# EAGLE schematic uFTDI4x4r1 (EAGLE 6.2)
Assembly variants: USB_BUS_POWERED, USB_SELF_POWERED, SMD_ONLY
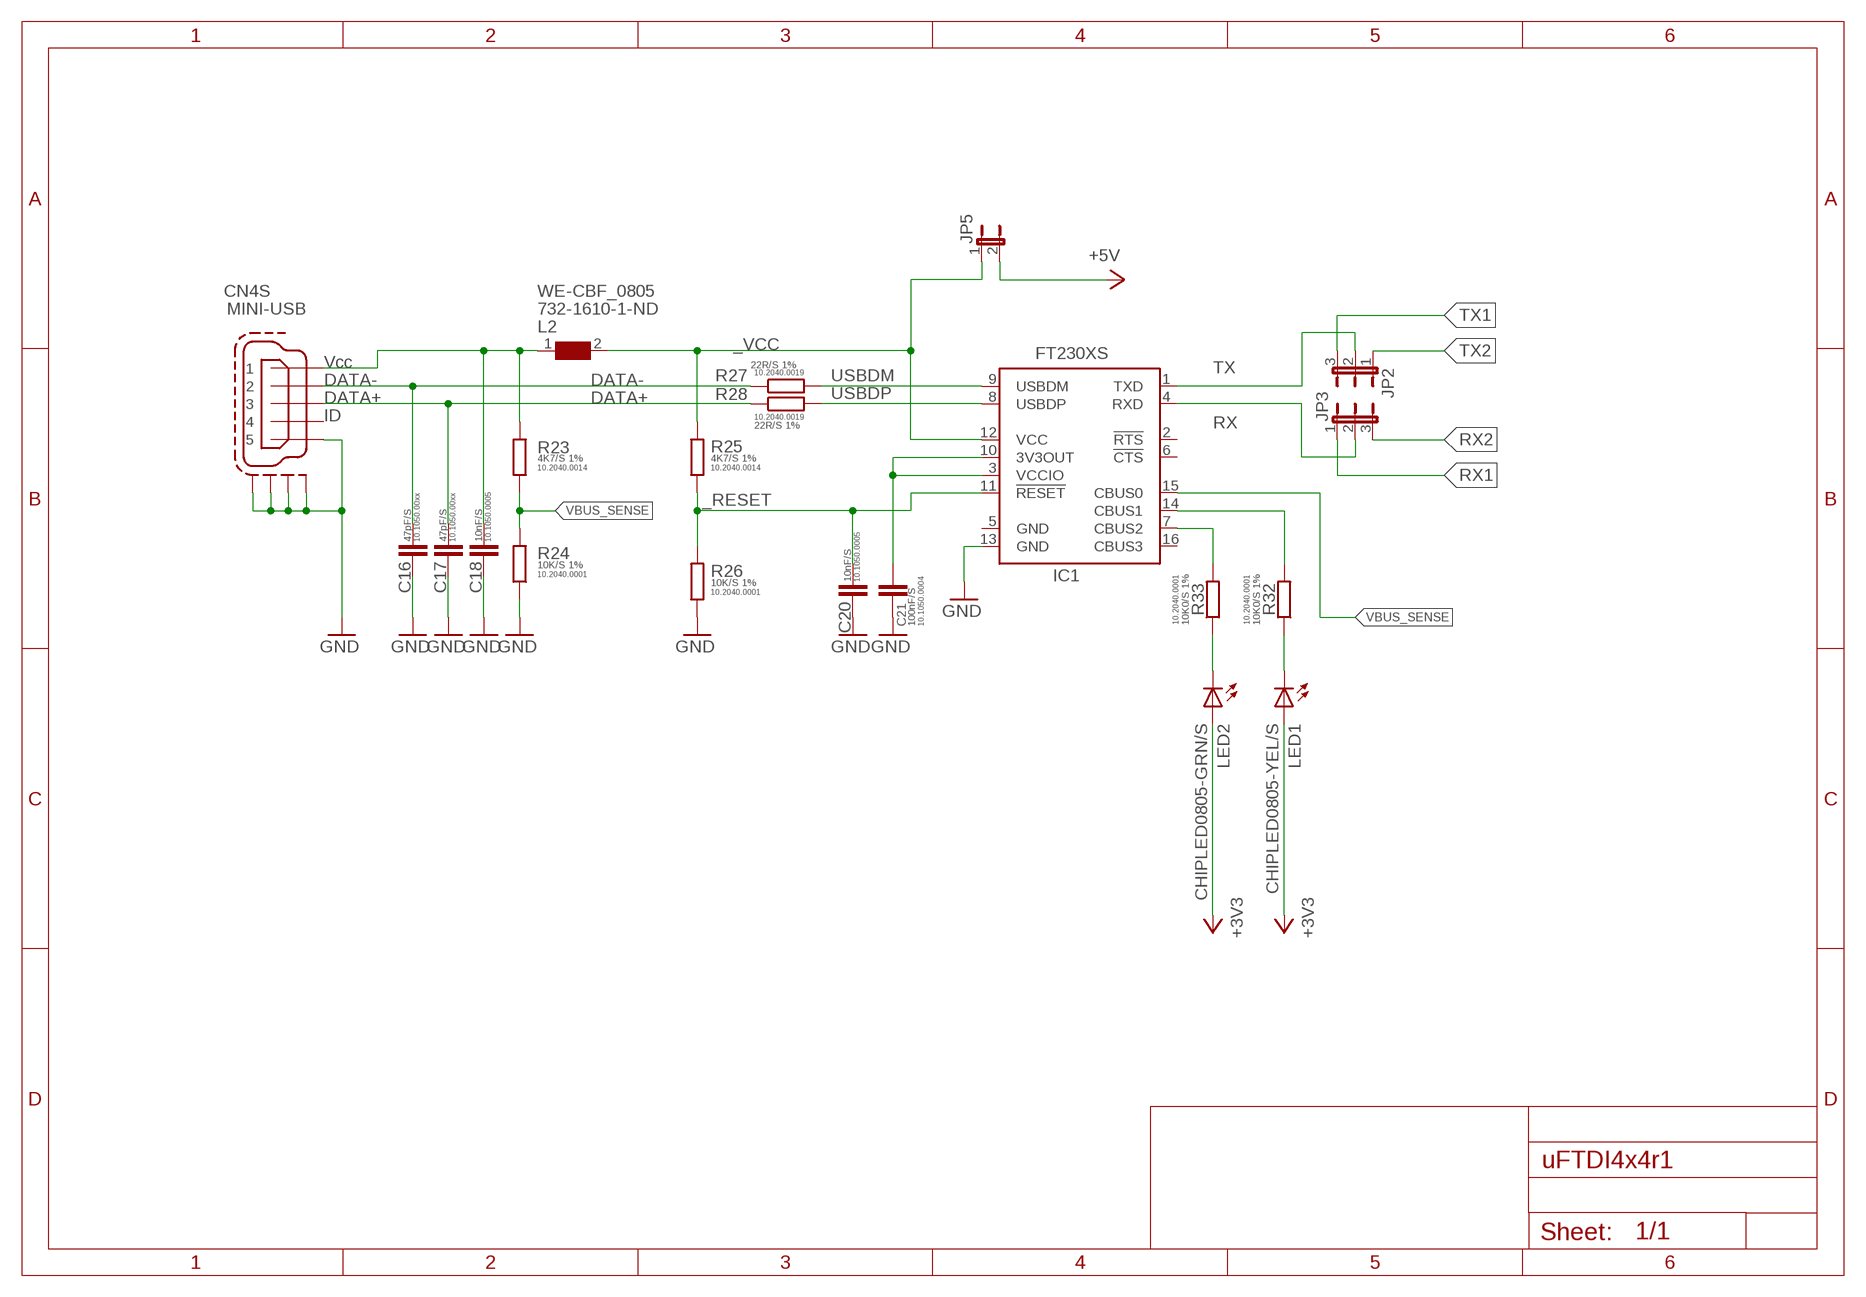
[diagram p0: schematic, sheet 1, part 1 of 2]
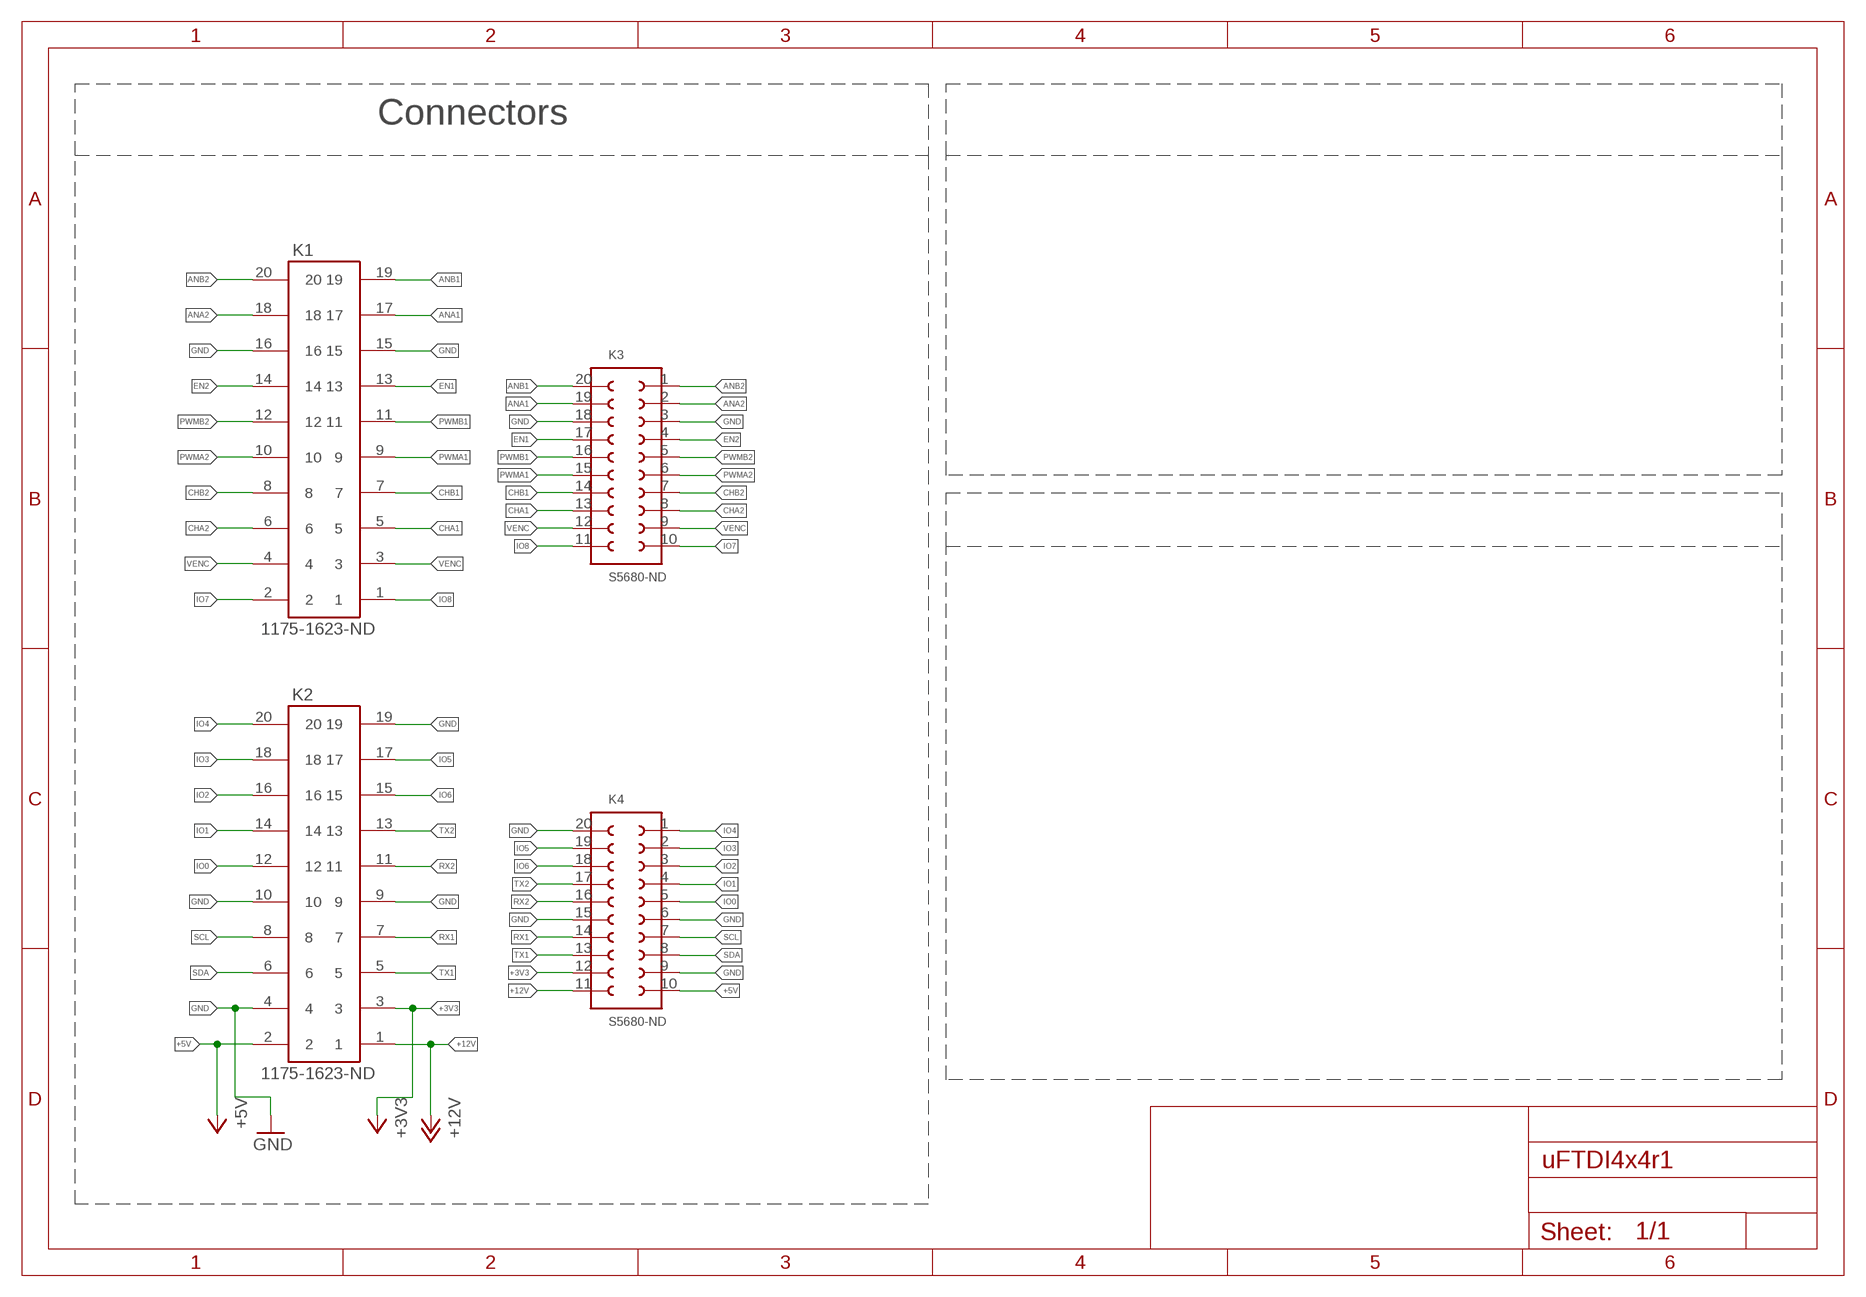
[diagram p1: schematic, sheet 1, part 2 of 2]

## Parts
C16  47pF/S  C-EUC0805  [C0805]
C17  47pF/S  C-EUC0805  [C0805]
C18  10nF/S  C-EUC0805  [C0805]
C20  10nF/S  C-EUC0805  [C0805]
C21  100nF/S  C-EUC0805  [C0805]
CN4  MINI-USB  MINI-USB-SCHIELD-32005-301  [32005-301]
IC1  FT230XS  [SSOP-16]
JP2  JP2E  [JP2]
JP3  JP2E  [JP2]
JP5  JP1E  [JP1]
K1  1175-1623-ND  612X2020621  [612X2020621]
K2  1175-1623-ND  612X2020621  [612X2020621]
K3  S5680-ND  61002021821  [61002021821]
K4  S5680-ND  61002021821  [61002021821]
L2  WE-CBF_0805  [0805]  (not fitted in variant USB_SELF_POWERED)  (not fitted in variant SMD_ONLY)
LED1  CHIPLED0805-YEL/S  LEDCHIPLED_0805  [CHIPLED_0805]
LED2  CHIPLED0805-GRN/S  LEDCHIPLED_0805  [CHIPLED_0805]
R23  4K7/S 1%  R-EU_R0805  [R0805]  (not fitted in variant USB_BUS_POWERED)
R24  10K/S 1%  R-EU_R0805  [R0805]  (not fitted in variant USB_BUS_POWERED)
R25  4K7/S 1%  R-EU_R0805  [R0805]
R26  10K/S 1%  R-EU_R0805  [R0805]
R27  22R/S 1%  R-EU_R0805  [R0805]
R28  22R/S 1%  R-EU_R0805  [R0805]
R32  10K0/S 1%  R-EU_R0805  [R0805]
R33  10K0/S 1%  R-EU_R0805  [R0805]

## Nets
+3V3: K2.3 K4.12 LED1.A LED2.A
+5V: JP5.2 K2.2 K4.10
+12V: K2.1 K4.11
_RESET: C20.2 IC1.11(!RESET) R25.1 R26.2
_VCC: IC1.12(VCC) JP5.1 L2.2 R25.2
ANA1: K1.17 K3.19
ANA2: K1.18 K3.2
ANB1: K1.19 K3.20
ANB2: K1.20 K3.1
CHA1: K1.5 K3.13
CHA2: K1.6 K3.8
CHB1: K1.7 K3.14
CHB2: K1.8 K3.7
DATA+: C17.2 CN4.3 R28.1
DATA-: C16.2 CN4.2 R27.1
EN1: K1.13 K3.17
EN2: K1.14 K3.4
GND: C16.1 C17.1 C18.1 C20.1 C21.1 CN4.5 CN4.M1(S:S1) CN4.M2(S:S2) CN4.M3(S:S3) CN4.M4(S:S4) IC1.13(GND) K1.15 K1.16 K2.4 K2.9 K2.10 K2.19 K3.3 K3.18 K4.6 K4.9 K4.15 K4.20 R24.1 R26.1
IO0: K2.12 K4.5
IO1: K2.14 K4.4
IO2: K2.16 K4.3
IO3: K2.18 K4.2
IO4: K2.20 K4.1
IO5: K2.17 K4.19
IO6: K2.15 K4.18
IO7: K1.2 K3.10
IO8: K1.1 K3.11
N$1: C21.2 IC1.3(VCCIO) IC1.10(3V3OUT)
N$4: IC1.7(CBUS2) R33.2
N$6: IC1.14(CBUS1) R32.2
N$13: C18.2 CN4.1 L2.1 R23.2
N$18: LED1.C R32.1
N$20: LED2.C R33.1
PWMA1: K1.9 K3.15
PWMA2: K1.10 K3.6
PWMB1: K1.11 K3.16
PWMB2: K1.12 K3.5
RX: IC1.4(RXD) JP3.2
RX1: JP3.1 K2.7 K4.14
RX2: JP3.3 K2.11 K4.16
SCL: K2.8 K4.7
SDA: K2.6 K4.8
TX: IC1.1(TXD) JP2.2
TX1: JP2.3 K2.5 K4.13
TX2: JP2.1 K2.13 K4.17
USBDM: IC1.9(USBDM) R27.2
USBDP: IC1.8(USBDP) R28.2
VBUS_SENSE: IC1.15(CBUS0) R23.1 R24.2
VENC: K1.3 K1.4 K3.9 K3.12
Unconnected: CN4.4 IC1.2(!RTS) IC1.6(!CTS) IC1.16(CBUS3)

## Notes on the sheet
- Connectors
- Vcc
- DATA-
- DATA+
- ID

## Power pins joined to a net without a drawn wire
GND: IC1.5(GND)

## Library data of the parts
C16 C17 = rcl:C-EU: CAPACITOR, European symbol; KATODO: 10.1050.00xx
C18 C20 = rcl:C-EU: CAPACITOR, European symbol; KATODO: 10.1050.0005
C21 = rcl:C-EU: CAPACITOR, European symbol; KATODO: 10.1050.0004
CN4 = pixsys:MINI-USB-SCHIELD-: MINI USB-B Conector Source: www.cypressindustries.com
IC1 = ftdichip:FT230X
JP2 JP3 = jumper:JP2E: JUMPER
JP5 = jumper:JP1E: JUMPER
K1 K2 = Wuerth_Elektronik_eiCan_Wire_to_Board_Connectors:612X2020621: WR-BHD 2.54mm Male SMT Box Header High Temperature, 20 Pins=>Code : Con_WTB_BHD_2.54_Male_SMT_612X2020621 <http://katalog.we-online.de/media/thumbs2/eican/thb_Con_WTB_BHD_2.54_Male_SMT_6120xx20621_pf2.jpg> Details see: http://katalog.we-online.de/en/em/612_0xx_206_21 Created 2014-06-05, Karrer Zheng 2014 (C) Würth Elektronik
K3 K4 = Wuerth_Elektronik_eiCan_Board_to_Board_Connectors:61002021821: WR-PHD 2.54mm Dual SMT Socket Header, 20 Pins=>Code : Con_BTB_SHD_2.54_1_SMT_61002021821 <http://katalog.we-online.de/media/images/eican/Con_BTB_SHD_2.54_1_SMT_6100xx21821_pf2.jpg> Details see: http://katalog.we-online.de/en/em/610_0xx_218_21 Created 2014-05-30, Karrer Zheng 2014 (C) Würth Elektronik
L2 = Wuerth_Elektronik_eiSos_V6:WE-CBF: SMD EMI Suppression Ferrite Beads WE-CBF - Excellent anti-EMI properties - Low DC-restistance - Impedances till 3000 ohms - Rated current up to 6 A -- Reliable Ni-Sn electrodes -- Perfect as data lined filter and for uncoupling of distribution voltage; DIGIKEY: 732-1610-1-ND; WURTH: http://katalog.we-online.de/pbs/datasheet/742792095.pdf
LED1 LED2 = led:LED: LED OSRAM: - CHIPLED LG R971, LG N971, LY N971, LG Q971, LY Q971, LO R971, LY R971 LH N974, LH R974 LS Q976, LO Q976, LY Q976 LO Q996 - Hyper CHIPLED LW Q18S LB Q993, LB Q99A, LB R99A - SideLED LS A670, LO A670, LY A670, LG A670, LP A670 LB A673, LV A673, LT A673, LW A673 LH A674 LY A675 LS A676, LA A676, LO A676, LY A676, LW A676 LS A679, LY A679, LG A679 - Hyper Micro SIDELED® LS Y876, LA Y876, LO Y876, LY Y876 LT Y87S - SmartLED LW L88C, LW L88S LB L89C, LB L89S, LG L890 LS L89K, LO L89K, LY L89K LS L896, LA L896, LO L896, LY L896 - TOPLED LS T670, LO T670, LY T670, LG T670, LP T670 LSG T670, LSP T670, LSY T670, LOP T670, LYG T670 LG T671, LOG T671, LSG T671 LB T673, LV T673, LT T673, LW T673 LH T674 LS T676, LA T676, LO T676, LY T676, LB T676, LH T676, LSB T676, LW T676 LB T67C, LV T67C, LT T67C, LS T67K, LO T67K, LY T67K, LW E67C LS E67B, LA E67B, LO E67B, LY E67B, LB E67C, LV E67C, LT E67C LW T67C LS T679, LY T679, LG T679 LS T770, LO T770, LY T770, LG T770, LP T770 LB T773, LV T773, LT T773, LW T773 LH T774 LS E675, LA E675, LY E675, LS T675 LS T776, LA T776, LO T776, LY T776, LB T776 LHGB T686 LT T68C, LB T68C - Hyper Mini TOPLED® LB M676 - Mini TOPLED Santana® LG M470 LS M47K, LO M47K, LY M47K Source: http://www.osram.convergy.de LUXEON: - LUMILED® LXK2-PW12-R00, LXK2-PW12-S00, LXK2-PW14-U00, LXK2-PW14-V00 LXK2-PM12-R00, LXK2-PM12-S00, LXK2-PM14-U00 LXK2-PE12-Q00, LXK2-PE12-R00, LXK2-PE12-S00, LXK2-PE14-T00, LXK2-PE14-U00 LXK2-PB12-K00, LXK2-PB12-L00, LXK2-PB12-M00, LXK2-PB14-N00, LXK2-PB14-P00, LXK2-PB14-Q00 LXK2-PR12-L00, LXK2-PR12-M00, LXK2-PR14-Q00, LXK2-PR14-R00 LXK2-PD12-Q00, LXK2-PD12-R00, LXK2-PD12-S00 LXK2-PH12-R00, LXK2-PH12-S00 LXK2-PL12-P00, LXK2-PL12-Q00, LXK2-PL12-R00 Source: www.luxeon.com KINGBRIGHT: KA-3528ASYC Source: www.kingbright.com
R23 R25 = rcl:R-EU_: RESISTOR, European symbol; KATODO: 10.2040.0014
R24 R26 R32 R33 = rcl:R-EU_: RESISTOR, European symbol; KATODO: 10.2040.0001
R27 R28 = rcl:R-EU_: RESISTOR, European symbol; KATODO: 10.2040.0019

## Net classes
0 default: width 0.254 mm, drill 0.406 mm, clearance 0.203 mm
1 power: width 0.305 mm, clearance 0.203 mm